# EAGLE design Tachometer v1.0 (EAGLE 6.6.0)
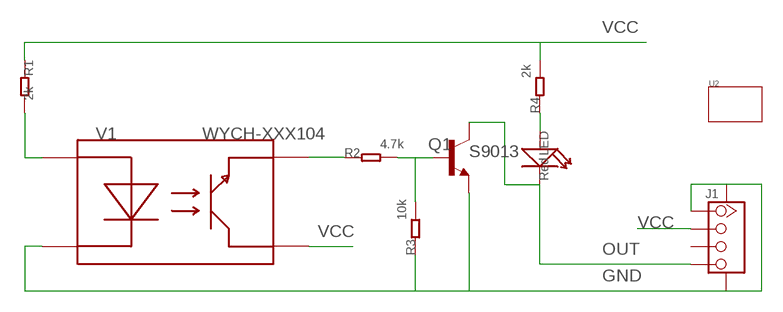
[diagram p0: schematic, sheet 1]

## Parts
J1  TWIG-4P-2.0-SMD-FEMALE-REINFORCE'DD'  [4P-SMD-2.0]
LED  Red  LED'0603'  [LED-0603]
Q1  S9013  TRANSISTOR_NPNSOT23-3  [SOT23-3]
R1  2k  R-0603  [R0603]
R2  4.7k  R-0603  [R0603]
R3  10k  R-0603  [R0603]
R4  2k  R-0603  [R0603]
U2  TWIG-2U  [2U-DIM-W/-DRILL]
V1  WYCH-XXX104  [WYCH104]

## Nets
GND: J1.1 J1.SS1 J1.SS2 Q1.2(E) R3.1 V1.2
N$1: R1.2 V1.1
N$3: Q1.1(B) R2.2 R3.2
N$4: R2.1 V1.4
N$5: LED.+ R4.1
OUT: J1.4 LED.- Q1.3(C)
VCC: J1.2 R1.1 R4.2 V1.3
Unconnected: J1.3

## Library data of the parts
J1 = Connector:TWIG-4P-2.0-SMD-FEMALE-REINFORCE
LED = Discrete:LED*
Q1 = SparkFun:TRANSISTOR_NPN: Transistor NPN BJT configuration in SOT23 package. MMBT2222 is the common NPN we use. Double check BCE configuration again layout.
R1-R4 = Discrete:R*
U2 = 元件库-模块板:TWIG
V1 = 元件库-main:WYCH-XXX

## Board
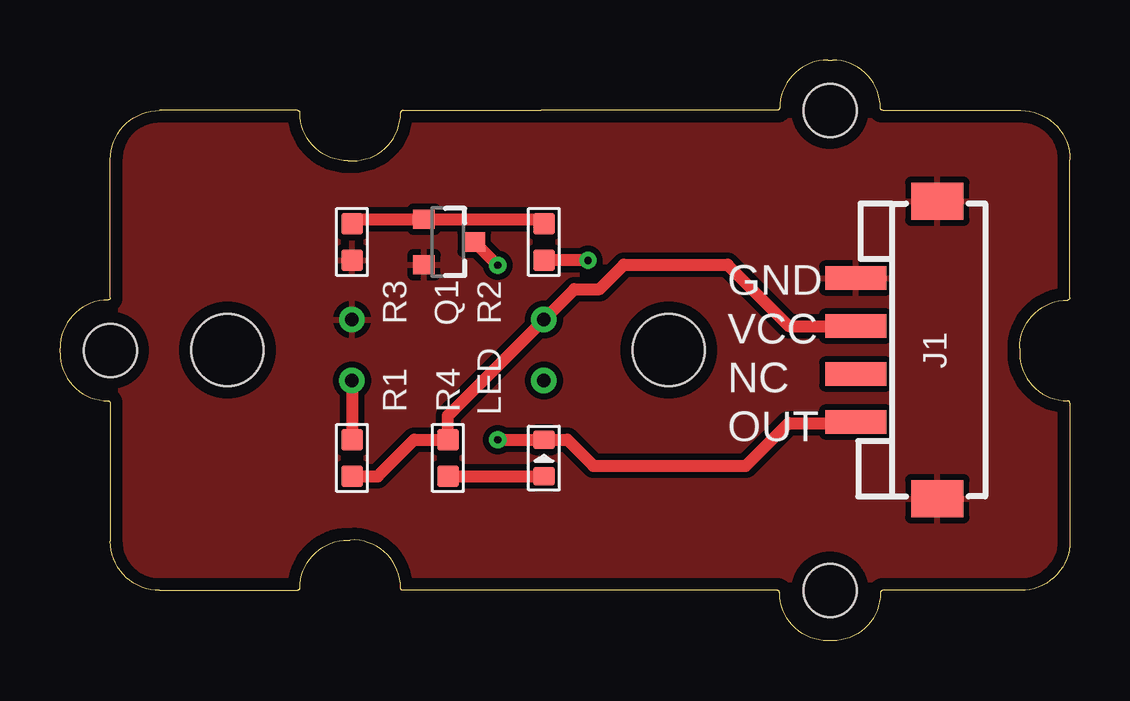
[diagram p1: board, top side]
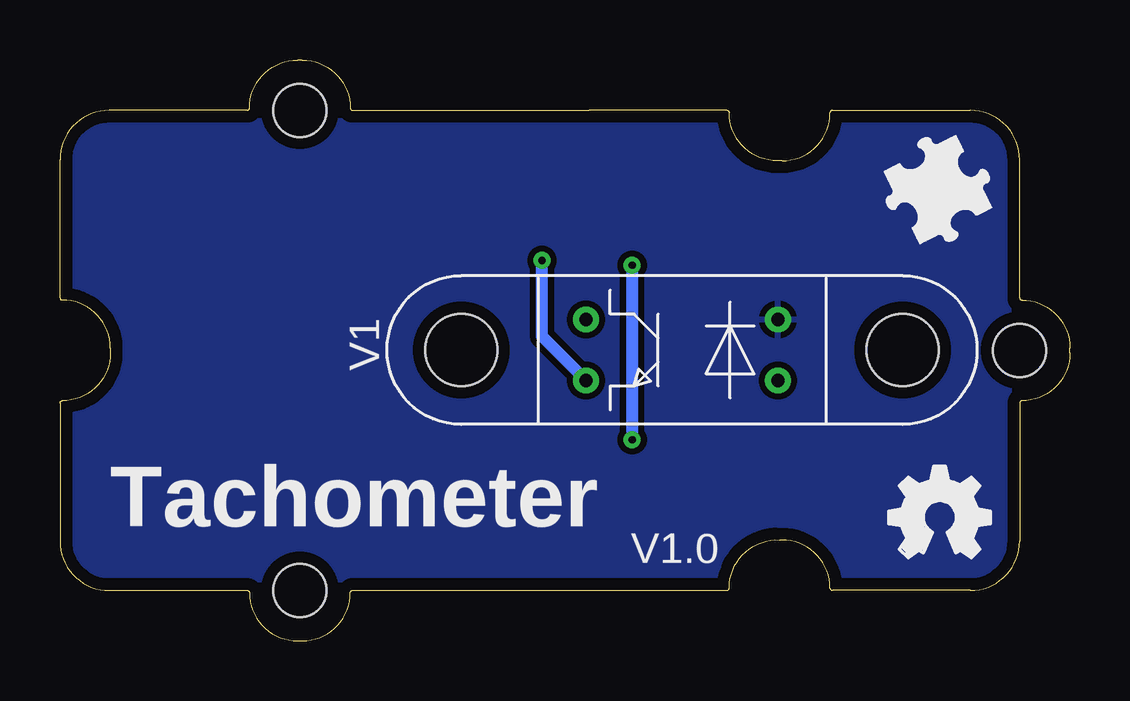
[diagram p2: board, bottom side, seen from below]

Size 42.1 x 24.2 mm. Coordinates in mm from the lower left corner, seen from the top.
Copper layers (1*16): Top 0.035mm / dielectric 1.5mm / Bottom 0.035mm
Design rules "default *": minimum track width 20mil, minimum drill 12mil, track to track 10mil, track to pad 8mil, pad to pad 8mil, via to via 8mil, smd to smd 8mil, copper to edge 20mil, drill to drill 10mil, minimum pad ring 10mil, minimum via ring 8mil, stop-mask expansion 4mil, vias tented up to drill 0mil, thermal gap 10mil

### Footprints (pad centres in the part's own frame; a part is rotated, then mirrored left to right if it is on the bottom)
4P-SMD-2.0 = smd 0.965 x 2.54: 1 -3,0; 2 -1,0; 3 1,0; 4 3,0 | smd 1.55 x 2.184: SS1 -6.2,3.4; SS2 6.2,3.4
LED-0603 = smd 0.762 x 0.889: + -0.762,0; - 0.762,0
SOT23-3 = smd 0.8 x 0.9: 1 -0.95,-1; 2 0.95,-1; 3 0,1.1
R0603 = smd 0.889 x 0.889: 1 -0.762,0; 2 0.762,0
2U-DIM-W/-DRILL = hole 2.2: 10,10; 10,-10; -20,0
WYCH104 = drill 0.559 pad 1.016: 1 -4,1.27; 2 -4,-1.27; 3 4,-1.27; 4 4,1.27 | hole 3: -9.2,0; 9.2,0

### Placement (x,y rotation side)
J1  33.17,12.12 270 top
LED  20.17,7.62 90 top
Q1  16.17,16.62 270 top
R1  12.17,7.62 90 top
R2  20.17,16.62 90 top
R3  12.17,16.62 90 top
R4  16.17,7.62 90 top
U2  22.1,12.1 0 top
U$3  [OSHW_FILLX150_NOTEXT]  7.56,3.46 0 bottom
U$4  [BRICK-LOGO-MIL-0.5]  8.04,16.25 0 bottom
V1  16.17,12.12 180 bottom

### Tracks (layer width: path | path; a pad name or v marks a point on that pad's centre or on a via)
GND
  pour Top: 0.01,12.12 0.01,-0.08 32.14,-0.08 42.18,-0.08 42.18,9.83 42.18,24.18 32.14,24.18 0.01,24.18
  pour Bottom: 0.01,12.12 0.01,-0.08 32.14,-0.08 42.18,-0.08 42.18,9.83 42.18,24.18 32.14,24.18 0.01,24.18
N$1
  Top 0.508: V1.1 R1.2
N$3
  Top 0.381: 20.17,17.57 R2.2
  Top 0.508: R3.2 12.36,17.57 Q1.1 19.98,17.57 arc-90 R2.2
N$4  (via drill 0.3 pad 0.25)
  Top 0.508: v22.01,15.85 v22,15.85 R2.1
  Bottom 0.508: V1.4 22.01,12.68 v22.01,15.85
N$5
  Top 0.508: R4.1 LED.+
OUT  (via drill 0.3 pad 0.25)
  Top 0.508: Q1.3 18.24,15.65 v18.25,15.65 | v18.25,8.38 LED.- 21.15,8.38 22.24,7.29 28.59,7.29 30.37,9.07 33.12,9.07 J1.4
  Bottom 0.508: v18.25,15.65 v18.25,8.38
VCC
  Top 0.508: R1.1 13.24,6.85 14.77,8.38 R4.2 16.17,9.39 V1.3 21.44,14.66 22.49,14.66 23.51,15.67 27.83,15.67 30.38,13.12 J1.2

### Text on the board
bPlace: Tachometer | V1.0
tNames: GND | VCC | NC | OUT